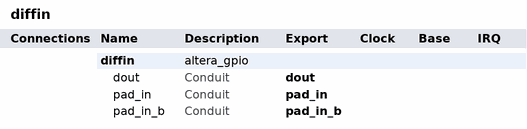
[diagram p0: system contents]
# Platform Designer (Qsys) system diffin, Arria 10 10AS066N2F40I2SGES
# Parameters at their usual value, and those the tool derives, are not listed.
package require -exact qsys 16.0
create_system diffin
set_project_property DEVICE_FAMILY {Arria 10}
set_project_property DEVICE 10AS066N2F40I2SGES

add_instance diffin altera_gpio 16.0
set_instance_property diffin AUTO_EXPORT true
set_instance_parameter_value diffin EXT_DRIVER_PARAM false
set_instance_parameter_value diffin GENERATE_SDC_FILE false
set_instance_parameter_value diffin IP_MIGRATE_PORT_MAP_FILE altiobuf_in_port_map.csv
set_instance_parameter_value diffin PIN_TYPE_GUI Input
set_instance_parameter_value diffin SIZE 1
set_instance_parameter_value diffin device_family {Arria 10}
set_instance_parameter_value diffin gui_areset_mode None
set_instance_parameter_value diffin gui_bus_hold false
set_instance_parameter_value diffin gui_diff_buff true
set_instance_parameter_value diffin gui_enable_cke false
set_instance_parameter_value diffin gui_enable_migratable_port_names true
set_instance_parameter_value diffin gui_enable_termination_ports false
set_instance_parameter_value diffin gui_hr_logic false
set_instance_parameter_value diffin gui_io_reg_mode none
set_instance_parameter_value diffin gui_open_drain false
set_instance_parameter_value diffin gui_pseudo_diff false
set_instance_parameter_value diffin gui_separate_io_clks false
set_instance_parameter_value diffin gui_sreset_mode None
set_instance_parameter_value diffin gui_use_oe false

# exported interfaces
add_interface dout conduit end
set_interface_property dout EXPORT_OF diffin.dout
add_interface pad_in conduit end
set_interface_property pad_in EXPORT_OF diffin.pad_in
add_interface pad_in_b conduit end
set_interface_property pad_in_b EXPORT_OF diffin.pad_in_b

set_interconnect_requirement {$system} qsys_mm.clockCrossingAdapter HANDSHAKE
set_interconnect_requirement {$system} qsys_mm.enableEccProtection FALSE
set_interconnect_requirement {$system} qsys_mm.insertDefaultSlave FALSE
set_interconnect_requirement {$system} qsys_mm.maxAdditionalLatency 1

save_system diffin.qsys
